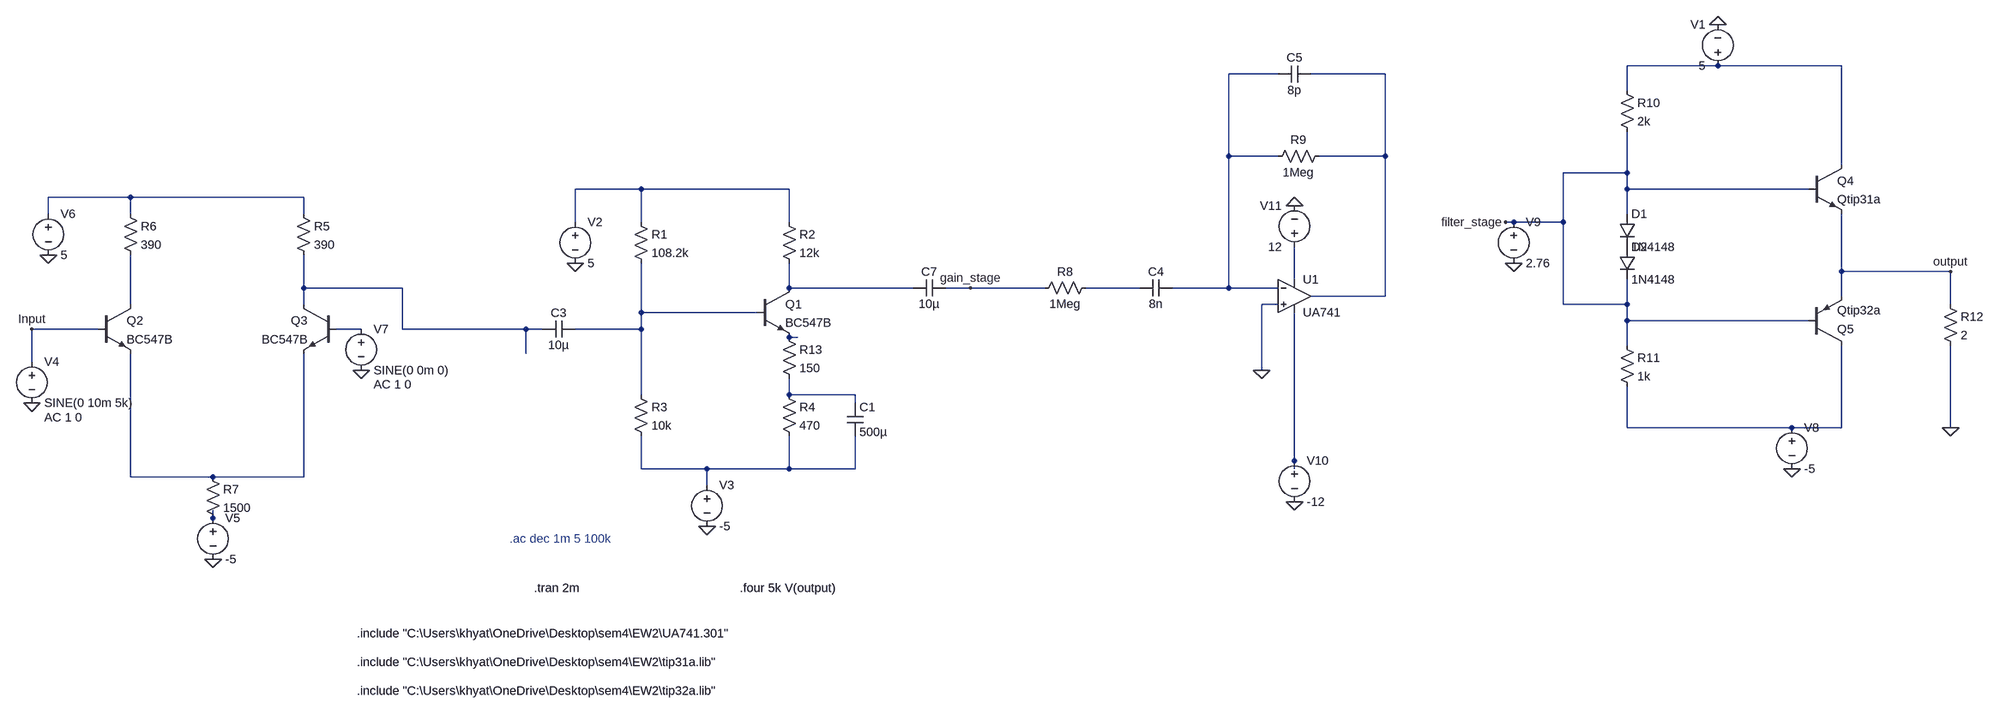
[diagram p0: schematic Final_Simulation.asc]
Final_Simulation.asc, the LTspice schematic file:
Version 4
SHEET 1 4216 1008
WIRE 2656 -224 2480 -224
WIRE 2896 -224 2656 -224
WIRE 1568 -208 1472 -208
WIRE 1776 -208 1632 -208
WIRE 2480 -176 2480 -224
WIRE 1472 -48 1472 -208
WIRE 1568 -48 1472 -48
WIRE 1776 -48 1776 -208
WIRE 1776 -48 1648 -48
WIRE 2896 -32 2896 -224
WIRE 2480 -16 2480 -96
WIRE 2480 -16 2192 -16
WIRE 192 16 64 16
WIRE 480 16 192 16
WIRE 2480 16 2480 -16
WIRE 2832 16 2480 16
WIRE -800 32 -960 32
WIRE -464 32 -800 32
WIRE -960 64 -960 32
WIRE -800 64 -800 32
WIRE -464 64 -464 32
WIRE 2480 64 2480 16
WIRE 64 80 64 16
WIRE 192 80 192 16
WIRE 480 80 480 16
WIRE 2096 80 2080 80
WIRE 2192 80 2192 -16
WIRE 2192 80 2096 80
WIRE 2896 176 2896 64
WIRE 3360 176 2896 176
WIRE 1600 192 1600 128
WIRE -464 208 -464 144
WIRE -272 208 -464 208
WIRE 480 208 480 160
WIRE 720 208 480 208
WIRE 832 208 784 208
WIRE 976 208 832 208
WIRE 1232 208 1056 208
WIRE 1472 208 1472 -48
WIRE 1472 208 1296 208
WIRE 1568 208 1472 208
WIRE 1776 224 1776 -48
WIRE 1776 224 1632 224
WIRE 2896 224 2896 176
WIRE -800 240 -800 144
WIRE -464 240 -464 208
WIRE 1568 240 1536 240
WIRE 2192 240 2192 80
WIRE 2480 240 2480 192
WIRE 2480 240 2192 240
WIRE 3360 240 3360 176
WIRE 192 256 192 160
WIRE 416 256 192 256
WIRE 2480 272 2480 240
WIRE 2832 272 2480 272
WIRE -864 288 -992 288
WIRE -352 288 -400 288
WIRE -272 288 -272 208
WIRE -32 288 -272 288
WIRE 0 288 -32 288
WIRE 192 288 192 256
WIRE 192 288 64 288
WIRE 496 304 480 304
WIRE 2480 320 2480 272
WIRE -32 336 -32 288
WIRE -992 352 -992 288
WIRE 1536 368 1536 240
WIRE 192 416 192 288
WIRE 480 416 480 384
WIRE 608 416 480 416
WIRE 608 432 608 416
WIRE 2480 480 2480 400
WIRE 2800 480 2480 480
WIRE 2896 480 2896 320
WIRE 2896 480 2800 480
WIRE 3360 480 3360 320
WIRE 1600 544 1600 256
WIRE 192 560 192 496
WIRE 320 560 192 560
WIRE 480 560 480 496
WIRE 480 560 320 560
WIRE 608 560 608 496
WIRE 608 560 480 560
WIRE 1600 560 1600 544
WIRE -800 576 -800 336
WIRE -640 576 -800 576
WIRE -464 576 -464 336
WIRE -464 576 -640 576
WIRE 320 592 320 560
WIRE -640 656 -640 640
FLAG 64 160 0
FLAG 320 672 0
FLAG -992 432 0
FLAG -640 736 0
FLAG -960 144 0
FLAG 1536 368 0
FLAG 2656 -304 0
FLAG 2800 560 0
FLAG 1600 48 0
FLAG 1600 624 0
FLAG 3360 480 0
FLAG -352 368 0
FLAG -992 288 Input
FLAG 832 208 gain_stage
FLAG 2080 80 filter_stage
FLAG 3360 176 output
FLAG 2096 160 0
DATAFLAG 480 192 ""
DATAFLAG 480 400 ""
DATAFLAG 192 288 ""
DATAFLAG 496 304 ""
DATAFLAG 608 208 ""
SYMBOL res 176 64 R0
SYMATTR InstName R1
SYMATTR Value 108.2k
SYMBOL res 464 64 R0
SYMATTR InstName R2
SYMATTR Value 12k
SYMBOL res 176 400 R0
SYMATTR InstName R3
SYMATTR Value 10k
SYMBOL res 464 400 R0
SYMATTR InstName R4
SYMATTR Value 470
SYMBOL cap 592 432 R0
SYMATTR InstName C1
SYMATTR Value 500µ
SYMBOL cap 64 272 R90
WINDOW 0 0 32 VBottom 2
WINDOW 3 32 32 VTop 2
SYMATTR InstName C3
SYMATTR Value 10µ
SYMBOL voltage 64 64 R0
WINDOW 123 0 0 Left 0
WINDOW 39 0 0 Left 0
SYMATTR InstName V2
SYMATTR Value 5
SYMBOL voltage 320 576 R0
WINDOW 123 0 0 Left 0
WINDOW 39 0 0 Left 0
SYMATTR InstName V3
SYMATTR Value -5
SYMBOL res -480 48 R0
SYMATTR InstName R5
SYMATTR Value 390
SYMBOL res -816 48 R0
SYMATTR InstName R6
SYMATTR Value 390
SYMBOL npn -864 240 R0
SYMATTR InstName Q2
SYMATTR Value BC547B
SYMBOL npn -400 240 M0
SYMATTR InstName Q3
SYMATTR Value BC547B
SYMBOL res -656 560 R0
SYMATTR InstName R7
SYMATTR Value 1500
SYMBOL voltage -992 336 R0
WINDOW 123 24 124 Left 2
WINDOW 39 0 0 Left 0
SYMATTR Value2 AC 1 0
SYMATTR InstName V4
SYMATTR Value SINE(0 10m 5k)
SYMBOL voltage -640 640 R0
WINDOW 123 0 0 Left 0
WINDOW 39 0 0 Left 0
SYMATTR InstName V5
SYMATTR Value -5
SYMBOL voltage -960 48 R0
WINDOW 123 0 0 Left 0
WINDOW 39 0 0 Left 0
SYMATTR InstName V6
SYMATTR Value 5
SYMBOL OpAmps\\opamp2 1600 160 R0
SYMATTR InstName U1
SYMATTR Value UA741
SYMBOL res 1072 192 R90
WINDOW 0 0 56 VBottom 2
WINDOW 3 32 56 VTop 2
SYMATTR InstName R8
SYMATTR Value 1Meg
SYMBOL res 1664 -64 R90
WINDOW 0 0 56 VBottom 2
WINDOW 3 32 56 VTop 2
SYMATTR InstName R9
SYMATTR Value 1Meg
SYMBOL npn 2832 -32 R0
SYMATTR InstName Q4
SYMATTR Value Qtip31a
SYMBOL pnp 2832 320 M180
SYMATTR InstName Q5
SYMATTR Value Qtip32a
SYMBOL res 2464 -192 R0
SYMATTR InstName R10
SYMATTR Value 2k
SYMBOL res 3344 224 R0
SYMATTR InstName R12
SYMATTR Value 2
SYMBOL diode 2464 64 R0
SYMATTR InstName D1
SYMATTR Value 1N4148
SYMBOL diode 2464 128 R0
SYMATTR InstName D2
SYMATTR Value 1N4148
SYMBOL res 2464 304 R0
SYMATTR InstName R11
SYMATTR Value 1k
SYMBOL voltage 2656 -208 R180
WINDOW 0 24 96 Left 2
WINDOW 3 24 16 Left 2
WINDOW 123 0 0 Left 0
WINDOW 39 0 0 Left 0
SYMATTR InstName V1
SYMATTR Value 5
SYMBOL voltage 2800 464 R0
WINDOW 123 0 0 Left 0
WINDOW 39 0 0 Left 0
SYMATTR InstName V8
SYMATTR Value -5
SYMBOL voltage 1600 528 R0
WINDOW 123 0 0 Left 0
WINDOW 39 0 0 Left 0
SYMATTR InstName V10
SYMATTR Value -12
SYMBOL voltage 1600 144 R180
WINDOW 0 24 96 Left 2
WINDOW 3 24 16 Left 2
WINDOW 123 0 0 Left 0
WINDOW 39 0 0 Left 0
SYMATTR InstName V11
SYMATTR Value 12
SYMBOL npn 416 208 R0
SYMATTR InstName Q1
SYMATTR Value BC547B
SYMBOL res 464 288 R0
SYMATTR InstName R13
SYMATTR Value 150
SYMBOL cap 1296 192 R90
WINDOW 0 0 32 VBottom 2
WINDOW 3 32 32 VTop 2
SYMATTR InstName C4
SYMATTR Value 8n
SYMBOL cap 1632 -224 R90
WINDOW 0 0 32 VBottom 2
WINDOW 3 32 32 VTop 2
SYMATTR InstName C5
SYMATTR Value 8p
SYMBOL cap 784 192 R90
WINDOW 0 0 32 VBottom 2
WINDOW 3 32 32 VTop 2
SYMATTR InstName C7
SYMATTR Value 10µ
SYMBOL voltage -352 272 R0
WINDOW 123 24 124 Left 2
WINDOW 39 0 0 Left 0
SYMATTR Value2 AC 1 0
SYMATTR InstName V7
SYMATTR Value SINE(0 0m 0)
SYMBOL voltage 2096 64 R0
WINDOW 123 0 0 Left 0
WINDOW 39 0 0 Left 0
SYMATTR InstName V9
SYMATTR Value 2.76
TEXT -64 696 Left 2 ;.ac dec 1m 5 100k
TEXT -360 880 Left 2 !.include "C:\\Users\\khyat\\OneDrive\\Desktop\\sem4\\EW2\\UA741.301"
TEXT -16 792 Left 2 !.tran 2m
TEXT -360 936 Left 2 !.include "C:\\Users\\khyat\\OneDrive\\Desktop\\sem4\\EW2\\tip31a.lib"
TEXT -360 992 Left 2 !.include "C:\\Users\\khyat\\OneDrive\\Desktop\\sem4\\EW2\\tip32a.lib"
TEXT 384 792 Left 2 !.four 5k V(output)

The netlist it stands for:
* Final_Simulation.asc
R1 N004 N011 108.2k
R2 N004 N008 12k
R3 N011 N017 10k
R4 N014 N017 470
C1 N014 N017 500µ
C3 N011 N007 10µ
V2 N004 0 5
V3 N017 0 -5
R5 N005 N007 390
R6 N005 N010 390
Q2 N010 Input N018 0 BC547B
Q3 N007 N012 N018 0 BC547B
R7 N018 N019 1500
V4 Input 0 SINE(0 10m 5k) AC 1 0
V5 N019 0 -5
V6 N005 0 5
XU1 0 N002 N006 N016 N003 UA741  ; pins In+ In- V+ V- OUT
R8 N009 gain_stage 1Meg
R9 N003 N002 1Meg
Q4 N001 filter_stage output 0 Qtip31a
Q5 N015 filter_stage output 0 Qtip32a
R10 N001 filter_stage 2k
R12 output 0 2
D1 filter_stage P001 1N4148
D2 P001 filter_stage 1N4148
R11 filter_stage N015 1k
V1 N001 0 5
V8 N015 0 -5
V10 N016 0 -12
V11 N006 0 12
Q1 N008 N011 N013 0 BC547B
R13 N013 N014 150
C4 N002 N009 8n
C5 N003 N002 8p
C7 gain_stage N008 10µ
V7 N012 0 SINE(0 0m 0) AC 1 0
V9 filter_stage 0 2.76
.model D D
.lib standard.dio
.model NPN NPN
.model PNP PNP
.lib standard.bjt
* .ac dec 1m 5 100k
.include "C:\Users\khyat\OneDrive\Desktop\sem4\EW2\UA741.301"
.tran 2m
.include "C:\Users\khyat\OneDrive\Desktop\sem4\EW2\tip31a.lib"
.include "C:\Users\khyat\OneDrive\Desktop\sem4\EW2\tip32a.lib"
.four 5k V(output)
.backanno
.end